# Altium schematic sheet STANDBY_POWER_SUPPLY.SchDoc
size A1
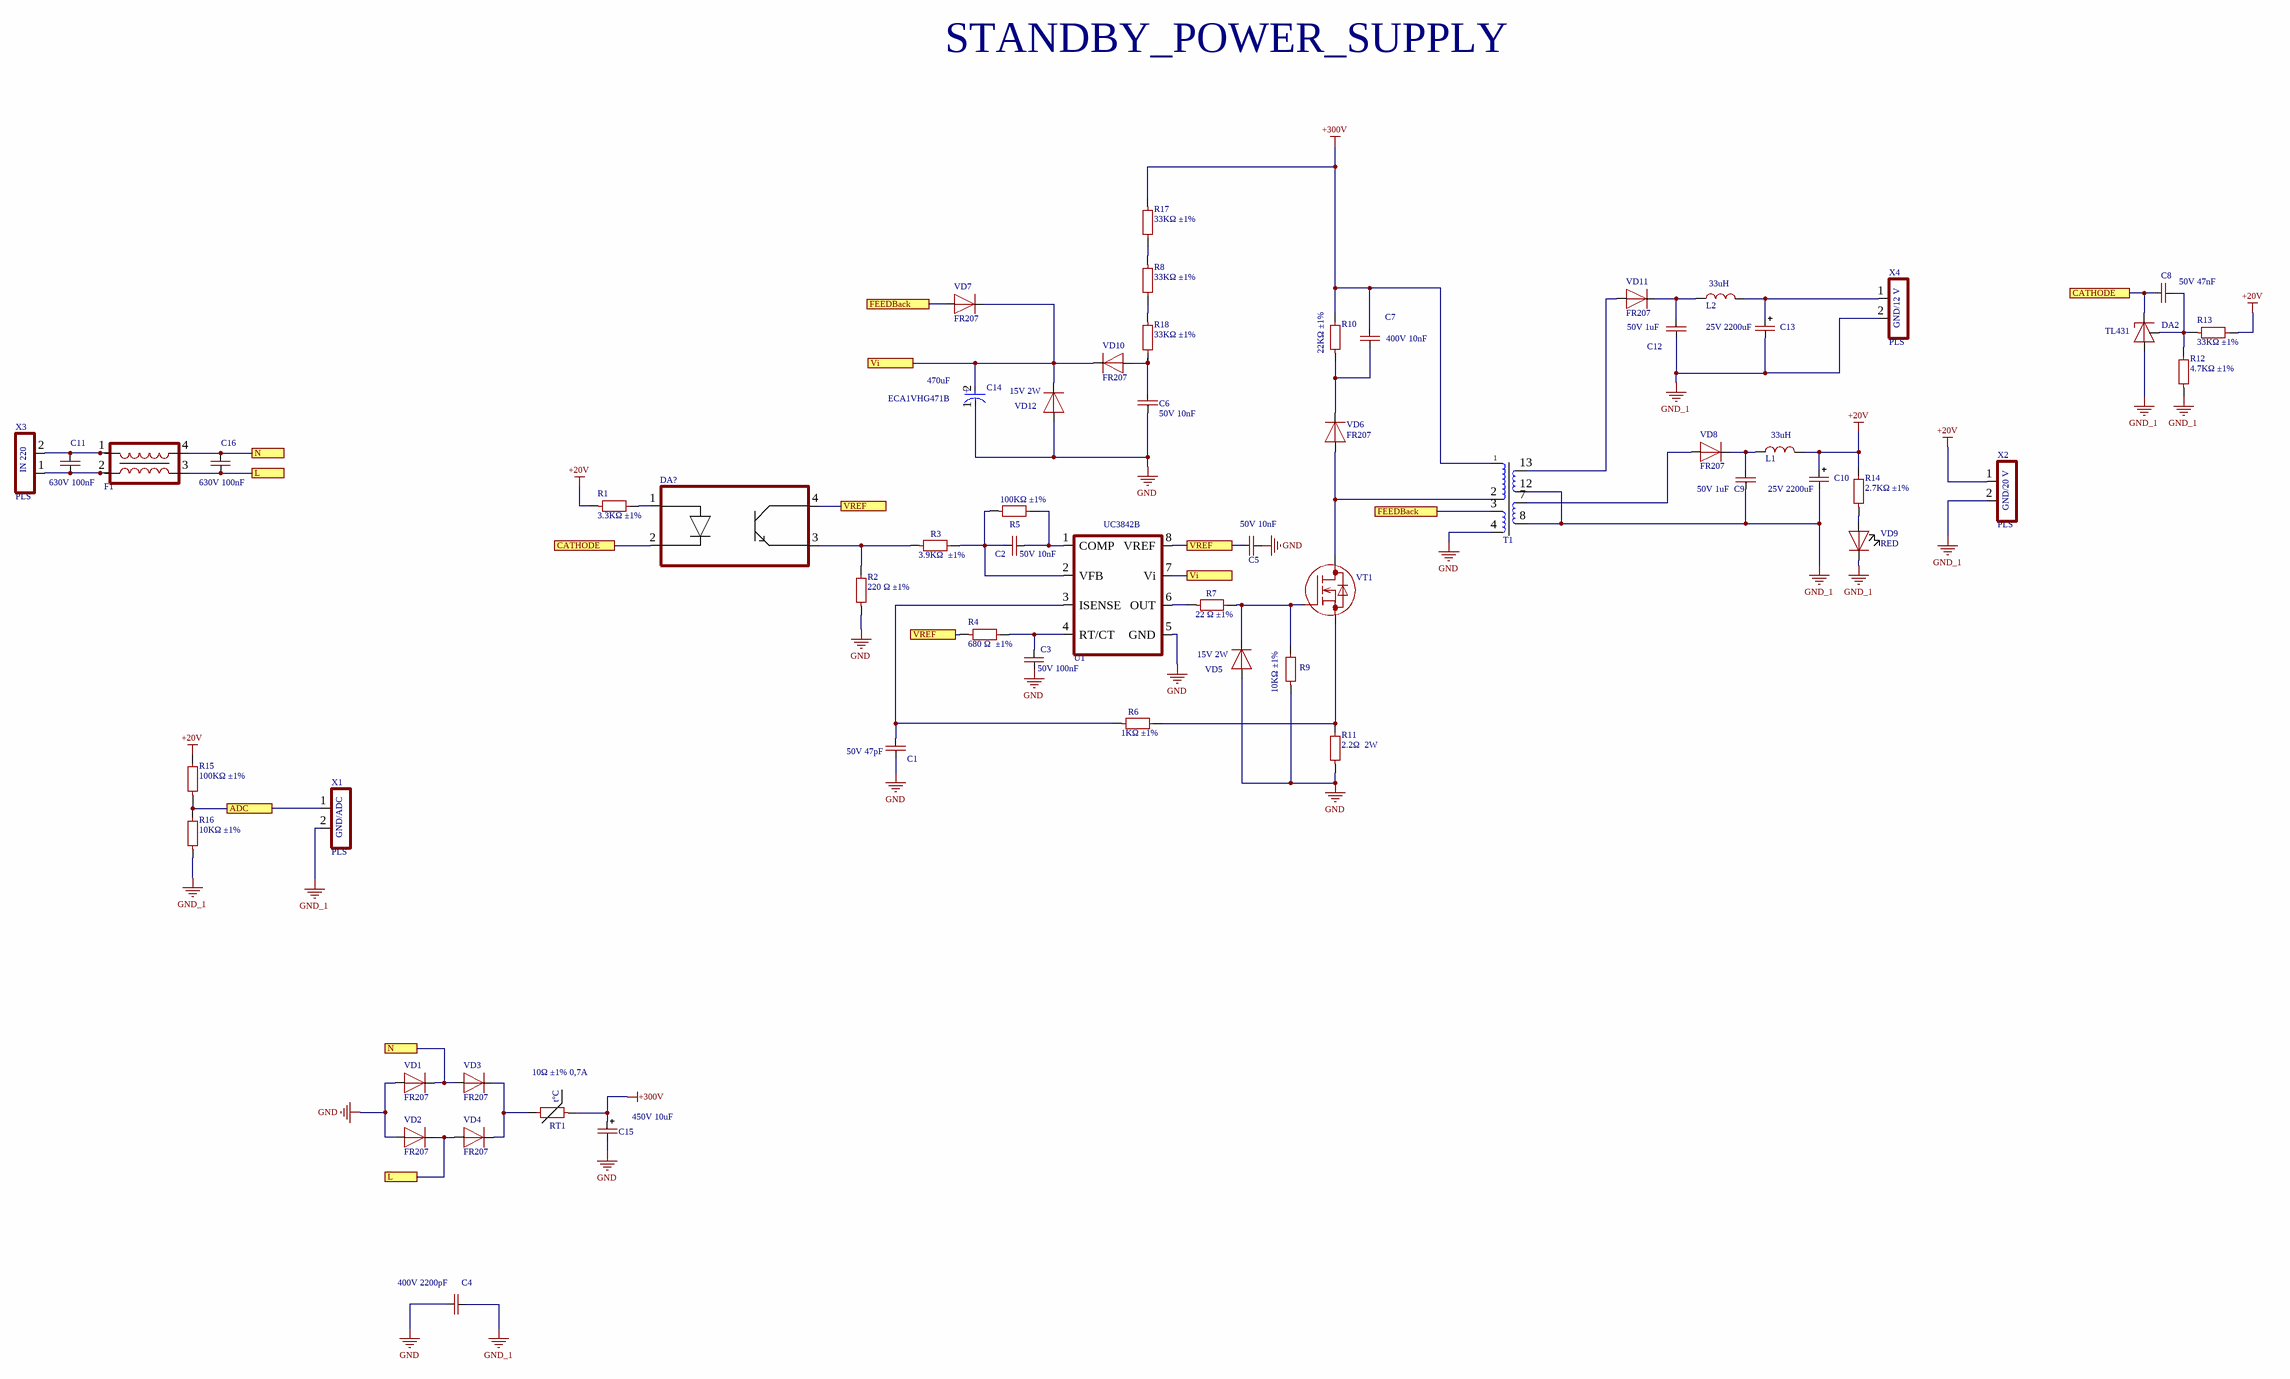
[diagram p0: STANDBY_POWER_SUPPLY.SchDoc]

## Parts
C1  value 50V 47pF  [CAP-0603]  (hidden comment: CAP-NON-POLAR)
C2  value 50V 10nF  [CAP-0603]  (hidden comment: CAP-NON-POLAR)
C3  value 50V 100nF  [CAP-0603]  (hidden comment: CAP-NON-POLAR)
C4  value 400V 2200pF  [CAP-V5]  (hidden comment: CAP-NON-POLAR)
C5  value 50V 10nF  [CAP-0603]  (hidden comment: CAP-NON-POLAR)
C6  50V 10nF  [CAP-0805]
C7  value 400V 10nF  [CAP-V5]  (hidden comment: CAP-NON-POLAR)
C8  value 50V 47nF  [CAP-0603]  (hidden comment: CAP-NON-POLAR)
C9  value 50V 1uF  [CAP-0603]  (hidden comment: CAP-NON-POLAR)
C10  value 25V 2200uF  [CAPPOL-12x25]  (hidden comment: CAP-POLAR)
C11  value 630V 100nF  [CAP-V15]  (hidden comment: CAP-NON-POLAR)
C12  value 50V 1uF  [CAP-0603]  (hidden comment: CAP-NON-POLAR)
C13  value 25V 2200uF  [CAPPOL-12x25]  (hidden comment: CAP-POLAR)
C14  ECA1VHG471B  Capacitance: 470uF  [FP-RAD-TH-D_10_0_5-L_16_1-MFG]
C15  value 450V 10uF  [CAPPOL-12x25]  (hidden comment: CAP-POLAR)
C16  value 630V 100nF  [CAP-V15]  (hidden comment: CAP-NON-POLAR)
DA2  TL431  [SOT23-3]
DA?  PC817  [4-SMD]  (value not drawn)
F1  FILTER  [FILTER_1]  (value not drawn)
L1  value 33uH  [IND-7850]  (hidden comment: IND-CONST)
L2  value 33uH  [IND-7850]  (hidden comment: IND-CONST)
R1  value 3.3KΩ ±1%  [RES-0603]  (hidden comment: RES-CONST)
R2  value 220 Ω ±1%  [RES-0603]  (hidden comment: RES-CONST)
R3  value 3.9KΩ  ±1%  [RES-0603]  (hidden comment: RES-CONST)
R4  value 680 Ω  ±1%  [RES-0603]  (hidden comment: RES-CONST)
R5  value 100KΩ ±1%  [RES-0603]  (hidden comment: RES-CONST)
R6  value 1KΩ ±1%  [RES-0603]  (hidden comment: RES-CONST)
R7  value 22 Ω ±1%  [RES-0603]  (hidden comment: RES-CONST)
R8  value 33KΩ ±1%  [RES-1206]  (hidden comment: RES-CONST)
R9  value 10KΩ ±1%  [RES-0603]  (hidden comment: RES-CONST)
R10  value 22KΩ ±1%  [RES-1206]  (hidden comment: RES-CONST)
R11  value 2.2Ω  2W  [RES-2W]  (hidden comment: RES-CONST)
R12  value 4.7KΩ ±1%  [RES-0603]  (hidden comment: RES-CONST)
R13  value 33KΩ ±1%  [RES-0603]  (hidden comment: RES-CONST)
R14  value 2.7KΩ ±1%  [RES-0603]  (hidden comment: RES-CONST)
R15  value 100KΩ ±1%  [RES-0603]  (hidden comment: RES-CONST)
R16  value 10KΩ ±1%  [RES-0603]  (hidden comment: RES-CONST)
R17  value 33KΩ ±1%  [RES-1206]  (hidden comment: RES-CONST)
R18  value 33KΩ ±1%  [RES-1206]  (hidden comment: RES-CONST)
RT1  value 10Ω ±1% 0,7A  [RES-V5]  (hidden comment: RES-TEMP)
T1  ETD29  [TRANS_ETD_29]  (value not drawn)
U1  UC3842B  [SOIC8-150]
VD1  FR207  [FR207]
VD2  FR207  [FR207]
VD3  FR207  [FR207]
VD4  FR207  [FR207]
VD5  value 15V 2W  [DO-35]  (hidden comment: DIODE)
VD6  FR207  [FR207]
VD7  FR207  [FR207]
VD8  FR207  [FR207]
VD9  value RED  [LED-0603]  (hidden comment: LED)
VD10  FR207  [FR207]
VD11  FR207  [FR207]
VD12  value 15V 2W  [DO-35]  (hidden comment: DIODE)
VT1  MOSFET-N-GDS  [TO-220(bend2)]  (value not drawn)
X1  GND/ADC  value PLS  [CONN-PLS-2-2.54mm]
X2  GND/20 V  value PLS  [CONN-PLS-2-2.54mm]
X3  IN 220  value PLS  [CONN-PLS-2-2.54mm]
X4  GND/12 V  value PLS  [CONN-PLS-2-2.54mm]

## Ports
ADC, CATHODE, FEEDBack, L, N, Vi, VREF

## Nets
+20V: C10.1(+) L1.2 R1.1 R13.2 R14.2 R15.2 X2.1
+300V: C7.2 C15.1(+) R10.2 R17.1 RT1.1 T1.1
GND: C1.1 C3.1 C4.2 C5.2 C6.2 C14.1(C) C15.2(-) R2.1 R9.1 R11.1 T1.4 U1.5(GND) VD1.2(A) VD2.2(A) VD5.2(A) VD12.2(A)
GND_1: C4.1 C9.1 C10.2(-) C12.1 C13.2(-) DA2.3(A) R12.1 R16.1 T1.8 T1.12 VD9.1(C) X1.2 X2.2 X4.2
ADC: R15.1 R16.2 X1.1 ; port ADC
CATHODE: C8.2 DA2.2(C) DA?.2(CATHODE) ; port CATHODE
FEEDBack: T1.3 VD7.2(A) ; port FEEDBack
L: C16.1 F1.3 VD2.1(C) VD4.2(A) ; port L
N: C16.2 F1.4 VD1.1(C) VD3.2(A) ; port N
Vi: C14.2(A) U1.7(Vi) VD7.1(C) VD10.1(C) VD12.1(C) ; port Vi
VREF: C5.1 DA?.4(COLLECTOR) R4.1 U1.8(VREF) ; port VREF
NetC1_2: C1.2 R6.1 U1.3(ISENSE)
NetC2_1: C2.1 R3.2 R5.1 U1.2(VFB)
NetC2_2: C2.2 R5.2 U1.1(COMP)
NetC3_2: C3.2 R4.2 U1.4(RT/CT)
NetC6_1: C6.1 R18.2 VD10.2(A)
NetC7_1: C7.1 R10.1 VD6.1(C)
NetC8_1: C8.1 DA2.1(REF) R12.2 R13.1
NetC9_2: C9.2 L1.1 VD8.1(C)
NetC11_1: C11.1 F1.2 X3.1
NetC11_2: C11.2 F1.1 X3.2
NetC12_2: C12.2 L2.1 VD11.1(C)
NetC13_1: C13.1(+) L2.2 X4.1
NetDA?_1: DA?.1(ANODE) R1.2
NetDA?_3: DA?.3(EMITTER) R2.2 R3.1
NetR6_2: R6.2 R11.2 VT1.3(S)
NetR7_1: R7.1 U1.6(OUT)
NetR7_2: R7.2 R9.2 VD5.1(C) VT1.1(G)
NetR8_1: R8.1 R17.2
NetR8_2: R8.2 R18.1
NetR14_1: R14.1 VD9.2(A)
NetRT1_2: RT1.2 VD3.1(C) VD4.1(C)
NetT1_2: T1.2 VD6.2(A) VT1.2(D)
NetT1_7: T1.7 VD8.2(A)
NetT1_13: T1.13 VD11.2(A)

## Notes on the sheet
- STANDBY_POWER_SUPPLY
- (in symbol CMP-05427-001499-1) +
- (in symbol KLS6-MF72-10D5) t°C

## Library data of the parts
C1-C3 C5 C8 C9 C12 = 2: Part Number: 2; №: 2
C4 C7 = 6: Part Number: 6; №: 6
C6 = 17: Part Number: 17; Value: 50V 100nF; №: 17
C10 C13 = 16: Part Number: 16; №: 16
C11 C16 = 18: Part Number: 18; №: 18
C14 = CMP-05427-001499-1: Aluminum Electrolytic Capacitors (Radial Lead Type) AEC-Q200 Qualified 470uF ±20% 35V; Lead Diameter: 0.6mm; Lead/Base Style: Straight; Polarity: Polar; Life (Hours): 2000Hour; Ripple Current: 460mA; Tolerance: 20%; Termination: Radial; Contact Plating: Tin; Length: 16mm; Voltage Rating: 35V; Max Operating Temperature: 105°C; Construction: RADIAL; Voltage Rating (DC): 35V; Radiation Hardening: No; Packaging: Tape and Reel; Diameter: 10mm; Series: NHG; Case/Package: Radial; Mount: Through Hole; Lead Pitch: 5mm; Height: 16mm; RoHS Compliant: Yes; Height - Seated (Max): 0.669inch; Min Operating Temperature: -55°C; Package Quantity: 500
C15 = 15: Part Number: 15; №: 15
DA2 = TL431: №: 9; ID: I-0009; Part Number: TL431; Value: TL431
DA? = 1: Part Number: 1; ID: O-0001; №: 1
F1 = DSF9L223А025: №: 4; ID: M-0004; Value: 0,65A; Part Number: DSF9L223А025
L1 L2 = 2: Part Number: 2; ID: L-0002; №: 2
R1 = 40: Part Number: 40; ID: R-0040; №: 40
R2 = 22: Part Number: 22; ID: R-0022; №: 22
R3 = 41: Part Number: 41; ID: R-0041; №: 41
R4 = 33: Part Number: 33; ID: R-0033; №: 33
R5 R15 = 73: Part Number: 73; ID: R-0073; №: 73
R6 = 37: Part Number: 37; ID: R-0037; №: 37
R7 = 2: Part Number: 2; ID: R-0002; №: 2
R8 R17 R18 = 206: Part Number: 206; ID: R-0206; №: 206
R9 R16 = 50: Part Number: 50; ID: R-0050; №: 50
R10 = 207: Part Number: 207; ID: R-0207; №: 207
R11 = 205: Part Number: 205; ID: R-0205; №: 205
R12 = 42: Part Number: 42; ID: R-0042; №: 42
R13 = 62: Part Number: 62; ID: R-0062; №: 62
R14 = 39: Part Number: 39; ID: R-0039; №: 39
RT1 = KLS6-MF72-10D5: №: 208; ID: R-0208; Part Number: KLS6-MF72-10D5
T1 = 3: №: 3; Value: XX; Part Number: 3
U1 = UC3842B: №: 5; ID: I-0005; Part Number: UC3842B
VD1-VD4 VD6-VD8 VD10 VD11 = FR207: №: 12; ID: D-0754; Value: 1000V 2A; Part Number: FR207
VD5 VD12 = BZX55C15V: №: 13; ID: D-0755; Part Number: BZX55C15V
VD9 = 2: Part Number: 2; ID: O-0002; №: 2
VT1 = IRF640_: №: 8; ID: T-0008; Value: 200V 18A; Part Number: IRF640_
X1-X4 = 1: Part Number: 1; ID: X-0001; №: 1